# Altium schematic sheet Power Input.SchDoc
size A4
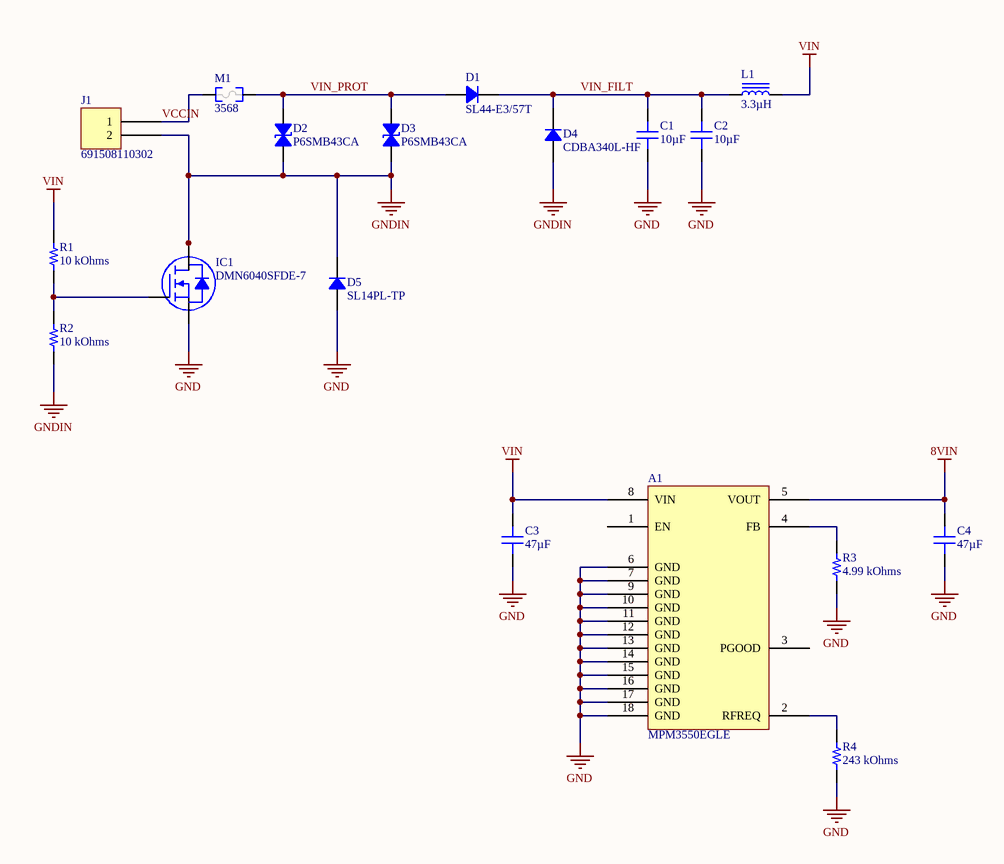
[diagram p0: Power Input.SchDoc]

## Parts
A1  MPM3550EGLE  [MPS LGA-18 12x12x4.2mm]
C1  10µF  [CAP 1210_3225 - 2.8MM]
C2  10µF  [CAP 1210_3225 - 2.8MM]
C3  47µF  [CAP 1210_3225 - 2.8MM]
C4  47µF  [CAP 1210_3225 - 2.8MM]
D1  SL44-E3/57T  [DO214AB SMC]
D2  P6SMB43CA  [DO214AA SMB]
D3  P6SMB43CA  [DO214AA SMB]
D4  CDBA340L-HF  [DO214AC SMA]
D5  SL14PL-TP  [SOD123F]
IC1  DMN6040SFDE-7  [DIODES U-DFN2020-6E]
J1  691508110302  [WURTH 691508110302]
L1  3.3µH  [BOURNS SRP5030T]
M1  3568  [KEYSTONE 3568]
R1  10 kOhms  [RES 0201_0603]
R2  10 kOhms  [RES 0201_0603]
R3  4.99 kOhms  [RES 0201_0603]
R4  243 kOhms  [RES 0201_0603]

## Nets
8VIN: A1.5(VOUT) C4.2
GND: A1.6(GND) A1.7(GND) A1.9(GND) A1.10(GND) A1.11(GND) A1.12(GND) A1.13(GND) A1.14(GND) A1.15(GND) A1.16(GND) A1.17(GND) A1.18(GND) C1.1 C2.1 C3.1 C4.1 D5.1 IC1.S R3.1 R4.1
GNDIN: D2.1 D3.1 D4.1 D5.2 IC1.D(Drain) J1.2 R2.1
VIN: A1.8(VIN) C3.2 L1.2 R1.1
VCCIN: J1.1 M1.1
VIN_FILT: C1.2 C2.2 D1.2 D4.2 L1.1
VIN_PROT: D1.1 D2.2 D3.2 M1.2
NetA1_2: A1.2(RFREQ) R4.2
NetA1_4: A1.4(FB) R3.2
NetIC1_G: IC1.G R1.2 R2.2

Not connected (* = marked no-connect by the designer): A1 1(EN) 3(PGOOD)

## Notes on the sheet
- Title
- Size:
- Date:
- A4
- Number:
- Time:
- Revision:
- Sheet
- of
- File:

## Library data of the parts
A1 = MPM3550EGLE: DC/DC POWER MODULE 5A 1.0 TO 12.; Manufacturer: Monolithic Power Systems Inc.; Efficiency: 94.6%; Number of Outputs: 1; Voltage - Input (Max): 36V; Voltage - Input (Min): 4.5V; Voltage - Output 1: 1 ~ 12V; Part Number: MPM3550EGLE; Applications: ITE (Commercial); ComponentLink1Description: Datasheet; ComponentLink1URL: https://www.monolithicpower.com/en/documentview/productdocument/index/doc_url/L20vcC9tcG0zNTUwZV9yMS4wLnBkZg/prod_id/MzE5Ng/; ComponentLink2Description: DigiKey Link; ComponentLink2URL: http://digikey.com/product-detail/en/monolithic-power-systems-inc/MPM3550EGLE/1589-2043-ND/10223607; Current - Output (Max): 5A; Device Package: 18-BLGA Module; Features: OCP, OTP, SCP, UVLO; LastUpdated: 05/04/2020 00:28:48; Lifecycle Status: Active; Minimum Order: 1; Mounting Type: Surface Mount; Operating Temperature: -40°C ~ 125°C; Package / Case: 18-BLGA Module; Packaging: Unknown; PartId: 26; Part Status: Active; Price: 9.16; Series: -; Size / Dimension: 0.47" L x 0.47" W x 0.17" H (12.0mm x 12.0mm x 4.2mm); Supplier 1: DigiKey; Supplier Part Number 1: 1589-2043-ND; Supplier Device Package: 18-LGA (12x12); Type: Non-Isolated PoL Module
C1 C2 = CL32B106KBJNNNE: CAP CER 10UF 50V X7R 1210; Manufacturer: Samsung Electro-Mechanics; Tolerance: ±10%; Part Number: CL32B106KBJNNNE; Value: 10µF; Applications: General Purpose; Capacitance: 10µF; ComponentLink1Description: Datasheet; ComponentLink1URL: http://www.samsungsem.com/kr/support/product-search/mlcc/CL32B106KBJNNNE .jsp; ComponentLink2Description: DigiKey Link; ComponentLink2URL: http://digikey.com/product-detail/en/samsung-electro-mechanics/CL32B106KBJNNNE/1276-3387-1-ND/3891473; Device Package: 1210 (3225 Metric); LastUpdated: 21/01/2020 00:30:21; Lifecycle Status: Active; Minimum Order: 1; Mounting Type: Surface Mount, MLCC; Operating Temperature: -55°C ~ 125°C; Package / Case: 1210 (3225 Metric); Packaging: TapeAndReel; PartId: 24115; Part Status: Active; Price: 0.17; Series: CL; Size / Dimension: 0.126" L x 0.098" W (3.20mm x 2.50mm); Supplier 1: DigiKey; Supplier Part Number 1: 1276-3387-1-ND; Temperature Coefficient: X7R; Thickness (Max): 0.106" (2.70mm); Voltage - Rated: 50V
C3 C4 = LMK325B7476MM-PR: CAP CER 47UF 10V X7R 1210; Manufacturer: Taiyo Yuden; Tolerance: ±20%; Part Number: LMK325B7476MM-PR; Value: 47µF; Applications: General Purpose; Capacitance: 47µF; ComponentLink1Description: Datasheet; ComponentLink1URL: https://www.yuden.co.jp/productdata/catalog/mlcc01_e.pdf; ComponentLink2Description: DigiKey Link; ComponentLink2URL: http://digikey.com/product-detail/en/taiyo-yuden/LMK325B7476MM-PR/587-5922-1-ND/7675042; Device Package: 1210 (3225 Metric); LastUpdated: 21/01/2020 00:30:21; Lifecycle Status: Active; Minimum Order: 1; Mounting Type: Surface Mount, MLCC; Operating Temperature: -55°C ~ 125°C; Package / Case: 1210 (3225 Metric); Packaging: TapeAndReel; PartId: 24091; Part Status: Active; Price: 0.28; Series: M; Size / Dimension: 0.126" L x 0.098" W (3.20mm x 2.50mm); Supplier 1: DigiKey; Supplier Part Number 1: 587-5922-1-ND; Temperature Coefficient: X7R; Thickness (Max): 0.106" (2.70mm); Voltage - Rated: 10V
D1 = SL44-E3/57T: DIODE SCHOTTKY 40V 4A DO214AB; Manufacturer: Vishay Semiconductor Diodes Division; Current - Reverse Leakage @ Vr: 500µA @ 40V; Speed: Fast Recovery =< 500ns, > 200mA (Io); Voltage - Forward (Vf) (Max) @ If: 440mV @ 4A; Part Number: SL44-E3/57T; ComponentLink1Description: Datasheet; ComponentLink1URL: http://www.vishay.com/docs/88742/sl42.pdf; ComponentLink2Description: DigiKey Link; ComponentLink2URL: http://digikey.com/product-detail/en/vishay-semiconductor-diodes-division/SL44-E3-57T/SL44-E3-57TGICT-ND/1091623; Current - Average Rectified (Io): 4A; Device Package: DO-214AB, SMC; Diode Type: Schottky; LastUpdated: 21/01/2020 02:38:50; Lifecycle Status: Active; Minimum Order: 1; Mounting Type: Surface Mount; Operating Temperature - Junction: -55°C ~ 125°C; Package / Case: DO-214AB, SMC; Packaging: TapeAndReel; PartId: 1768; Part Status: Active; Price: 0.42; Series: -; Supplier 1: DigiKey; Supplier Part Number 1: SL44-E3/57TGICT-ND; Supplier Device Package: DO-214AB (SMC); Voltage - DC Reverse (Vr) (Max): 40V
D2 D3 = P6SMB43CA: TVS DIODE 36.8V 59.3V DO214AA; Manufacturer: Bourns Inc.; Bidirectional Channels: 1; Current - Peak Pulse (10/1000µs): 10.3A; Power Line Protection: No; Power - Peak Pulse: 600W; Type: Zener; Voltage - Breakdown (Min): 40.9V; Part Number: P6SMB43CA; Applications: General Purpose; ComponentLink1Description: Datasheet; ComponentLink1URL: https://www.bourns.com/docs/Product-Datasheets/P6SMB.pdf; ComponentLink2Description: DigiKey Link; ComponentLink2URL: http://digikey.com/product-detail/en/bourns-inc/P6SMB43CA/P6SMB43CABBCT-ND/6708253; Device Package: DO-214AA, SMB; LastUpdated: 21/03/2020 01:01:48; Lifecycle Status: Active; Minimum Order: 1; Mounting Type: Surface Mount; Operating Temperature: -55°C ~ 150°C (TJ); Package / Case: DO-214AA, SMB; Packaging: TapeAndReel; PartId: 8863; Part Status: Active; Price: 0.11; Series: -; Supplier 1: DigiKey; Supplier Part Number 1: P6SMB43CABBCT-ND; Supplier Device Package: DO-214AA (SMB); Voltage - Clamping (Max) @ Ipp: 59.3V; Voltage - Reverse Standoff (Typ): 36.8V
D4 = CDBA340L-HF: DIODE SCHOTTKY 40V 3A DO214AC; Manufacturer: Comchip Technology; Capacitance @ Vr, F: 300pF @ 4V, 1MHz; Current - Average Rectified (Io): 3A (DC); Current - Reverse Leakage @ Vr: 1mA @ 40V; Speed: Fast Recovery =< 500ns, > 200mA (Io); Voltage - Forward (Vf) (Max) @ If: 400mV @ 3A; Part Number: CDBA340L-HF; ComponentLink1Description: Datasheet; ComponentLink1URL: http://www.comchiptech.com/admin/files/product/CDBA340L-HF%20RevC514368.pdf; ComponentLink2Description: DigiKey Link; ComponentLink2URL: http://digikey.com/product-detail/en/comchip-technology/CDBA340L-HF/641-1702-1-ND/5226085; Device Package: DO-214AC, SMA; Diode Type: Schottky; LastUpdated: 02/02/2020 10:17:41; Lifecycle Status: Active; Minimum Order: 1; Mounting Type: Surface Mount; Operating Temperature - Junction: -50°C ~ 100°C; Package / Case: DO-214AC, SMA; Packaging: TapeAndReel; PartId: 1972; Part Status: Active; Price: 0.20; Series: -; Supplier 1: DigiKey; Supplier Part Number 1: 641-1702-1-ND; Supplier Device Package: DO-214AC (SMA); Voltage - DC Reverse (Vr) (Max): 40V
D5 = SL14PL-TP: DIODE SCHOTTKY 1A 40V SOD-123FL; Manufacturer: Micro Commercial Co; Current - Reverse Leakage @ Vr: 500µA @ 40V; Speed: Fast Recovery =< 500ns, > 200mA (Io); Voltage - Forward (Vf) (Max) @ If: 400mV @ 1A; Part Number: SL14PL-TP; ComponentLink1Description: Datasheet; ComponentLink1URL: https://www.mccsemi.com/pdf/Products/SL14PL-SL110PL(SOD-123FL)-B.pdf; ComponentLink2Description: DigiKey Link; ComponentLink2URL: http://digikey.com/product-detail/en/micro-commercial-co/SL14PL-TP/SL14PL-TPMSCT-ND/7681629; Current - Average Rectified (Io): 1A; Device Package: SOD-123F; Diode Type: Schottky; LastUpdated: 21/01/2020 02:43:49; Lifecycle Status: Active; Minimum Order: 1; Mounting Type: Surface Mount; Operating Temperature - Junction: -55°C ~ 150°C; Package / Case: SOD-123F; Packaging: TapeAndReel; PartId: 2344; Part Status: Active; Price: 0.06; Series: -; Supplier 1: DigiKey; Supplier Part Number 1: SL14PL-TPMSCT-ND; Supplier Device Package: SOD-123FL; Voltage - DC Reverse (Vr) (Max): 40V
IC1 = DMN6040SFDE-7: MOSFET N-CH 60V 5.3A U-DFN; Manufacturer: Diodes Incorporated; Current - Continuous Drain (Id) @ 25°C: 5.3A (Ta); Drive Voltage (Max Rds On,  Min Rds On): 4.5V, 10V; FET Type: N-Channel; Gate Charge (Qg) (Max) @ Vgs: 22.4nC @ 10V; Input Capacitance (Ciss) (Max) @ Vds: 1287pF @ 25V; Power Dissipation (Max): 660mW (Ta); Rds On (Max) @ Id, Vgs: 38mOhm @ 4.3A, 10V; Vgs (Max): ±20V; Vgs(th) (Max) @ Id: 3V @ 250µA; Part Number: DMN6040SFDE-7; ComponentLink1Description: Datasheet; ComponentLink1URL: https://www.diodes.com/assets/Datasheets/DMN6040SFDE.pdf; ComponentLink2Description: DigiKey Link; ComponentLink2URL: http://digikey.com/product-detail/en/diodes-incorporated/DMN6040SFDE-7/DMN6040SFDE-7DICT-ND/3451573; Device Package: 6-UDFN Exposed Pad; Drain to Source Voltage (Vdss): 60V; LastUpdated: 30/03/2020 13:01:59; Lifecycle Status: Active; Minimum Order: 1; Mounting Type: Surface Mount; Operating Temperature: -55°C ~ 150°C (TJ); Package / Case: 6-UDFN Exposed Pad; Packaging: TapeAndReel; Part Status: Active; Price: 0.20; Series: -; Supplier 1: DigiKey; Supplier Part Number 1: DMN6040SFDE-7DICT-ND; Supplier Device Package: U-DFN2020-6 (Type E); Technology: MOSFET (Metal Oxide)
J1 = 691508110302: TERM BLOCK 2POS 3.5MM SMD; Manufacturer: Würth Elektronik; Current: 10A; Mating Orientation: Horizontal and Vertical with Board; Number of Levels: 1; Pitch: 0.138" (3.50mm); Positions Per Level: 2; Voltage: 300V; Wire Gauge: 16-30 AWG; Wire Termination: Screw - Rising Cage Clamp; Part Number: 691508110302; Color: Black; ComponentLink1Description: Datasheet; ComponentLink1URL: https://katalog.we-online.de/em/datasheet/6915081103xx.pdf; ComponentLink2Description: DigiKey Link; ComponentLink2URL: http://digikey.com/product-detail/en/w-rth-elektronik/691508110302/732-5963-1-ND/5047612; Features: Board Guide, Mounting Flange; LastUpdated: 15/01/2020 04:18:55; Lifecycle Status: Active; Minimum Order: 1; Mounting Type: Surface Mount; Packaging: TapeAndReel; Part Status: Active; Price: 1.57; Series: WR-TBL Series 5081; Supplier 1: DigiKey; Supplier Part Number 1: 732-5963-1-ND
L1 = SRP5030T-3R3M: FIXED IND 3.3UH 5A 38 MOHM SMD; Manufacturer: Bourns Inc.; Current - Saturation: 8A; DC Resistance (DCR): 38mOhm Max; Inductance Frequency - Test: 100kHz; Material - Core: Iron Powder; Shielding: Shielded; Tolerance: ±20%; Type: Wirewound; Part Number: SRP5030T-3R3M; ComponentLink1Description: Datasheet; ComponentLink1URL: https://www.bourns.com/docs/Product-Datasheets/SRP5030T.pdf; ComponentLink2Description: DigiKey Link; ComponentLink2URL: http://digikey.com/product-detail/en/bourns-inc/SRP5030T-3R3M/SRP5030T-3R3MCT-ND/3986025; Current Rating (Amps): 5A; Device Package: Nonstandard; Height - Seated (Max): 0.118" (3.00mm); Inductance: 3.3µH; LastUpdated: 21/01/2020 03:25:23; Lifecycle Status: Active; Minimum Order: 1; Mounting Type: Surface Mount; Operating Temperature: -40°C ~ 125°C; Package / Case: Nonstandard; Packaging: TapeAndReel; PartId: 6; Part Status: Active; Price: 0.66; Series: SRP5030T; Size / Dimension: 0.224" L x 0.205" W (5.70mm x 5.20mm); Supplier 1: DigiKey; Supplier Part Number 1: SRP5030T-3R3MCT-ND; Value: 3.3µH
M1 = 3568: FUSE HOLDER BLADE 500V 30A PCB; Manufacturer: Keystone Electronics; For Use With/Related Products: MINI ATC, MINI ATO; Fuse Size: 0.43" L x 0.15" W x 0.347" H (10.92mm x 3.81mm x 8.81mm); Number of Circuits: 1; Part Number: 3568; ComponentLink1Description: Datasheet; ComponentLink1URL: http://keyelco.com/userAssets/file/M65p42.pdf; ComponentLink2Description: DigiKey Link; ComponentLink2URL: http://digikey.com/product-detail/en/keystone-electronics/3568/36-3568-ND/2137306; Contact Finish: Tin; Contact Material: Brass; Current Rating (Amps): 30A; Fuseholder Type: Holder; Fuse Type: Blade; LastUpdated: 05/04/2020 19:02:49; Lifecycle Status: Active; Minimum Order: 1; Mounting Type: Through Hole; Orientation: Vertical; Packaging: Unknown; Part Status: Active; Price: 1.03; Series: MINI® 297; Supplier 1: DigiKey; Supplier Part Number 1: 36-3568-ND; Termination Style: PC Pin; Voltage: 500V
R1 R2 = ERJ-1GNF1002C: RES SMD 10K OHM 1% 1/20W 0201; Manufacturer: Panasonic Electronic Components; Power (Watts): 0.05W, 1/20W; Temperature Coefficient: ±200ppm/°C; Part Number: ERJ-1GNF1002C; Value: 10 kOhms; ComponentLink1Description: Datasheet; ComponentLink1URL: https://industrial.panasonic.com/cdbs/www-data/pdf/RDA0000/AOA0000C304.pdf; ComponentLink2Description: DigiKey Link; ComponentLink2URL: http://digikey.com/product-detail/en/panasonic-electronic-components/ERJ-1GNF1002C/P122414CT-ND/7389440; Composition: Thick Film; Device Package: 0201 (0603 Metric); Features: Automotive AEC-Q200; Height - Seated (Max): 0.010" (0.26mm); LastUpdated: 21/01/2020 00:04:13; Lifecycle Status: Active; Minimum Order: 1; Number of Terminations: 2; Operating Temperature: -55°C ~ 125°C; Package / Case: 0201 (0603 Metric); Packaging: TapeAndReel; PartId: 2296; Part Status: Active; Price: 0.01; Ratings: AEC-Q200; Resistance: 10 kOhms; Series: ERJ; Size / Dimension: 0.024" L x 0.012" W (0.60mm x 0.30mm); Supplier 1: DigiKey; Supplier Part Number 1: P122414CT-ND; Supplier Device Package: 0201; Tolerance: ±1%
R3 = ERJ-1GNF4991C: RES SMD 4.99K OHM 1% 1/20W 0201; Manufacturer: Panasonic Electronic Components; Power (Watts): 0.05W, 1/20W; Temperature Coefficient: ±200ppm/°C; Part Number: ERJ-1GNF4991C; Value: 4.99 kOhms; ComponentLink1Description: Datasheet; ComponentLink1URL: https://industrial.panasonic.com/cdbs/www-data/pdf/RDA0000/AOA0000C304.pdf; ComponentLink2Description: DigiKey Link; ComponentLink2URL: http://digikey.com/product-detail/en/panasonic-electronic-components/ERJ-1GNF4991C/P123046CT-ND/8343031; Composition: Thick Film; Device Package: 0201 (0603 Metric); Features: Automotive AEC-Q200; Height - Seated (Max): 0.010" (0.26mm); LastUpdated: 21/01/2020 00:04:10; Lifecycle Status: Active; Minimum Order: 1; Number of Terminations: 2; Operating Temperature: -55°C ~ 125°C; Package / Case: 0201 (0603 Metric); Packaging: TapeAndReel; PartId: 4175; Part Status: Active; Price: 0.01; Ratings: AEC-Q200; Resistance: 4.99 kOhms; Series: ERJ; Size / Dimension: 0.024" L x 0.012" W (0.60mm x 0.30mm); Supplier 1: DigiKey; Supplier Part Number 1: P123046CT-ND; Supplier Device Package: 0201; Tolerance: ±1%
R4 = ERJ-1GNF2433C: RES SMD 243K OHM 1% 1/20W 0201; Manufacturer: Panasonic Electronic Components; Power (Watts): 0.05W, 1/20W; Temperature Coefficient: ±200ppm/°C; Part Number: ERJ-1GNF2433C; Value: 243 kOhms; ComponentLink1Description: Datasheet; ComponentLink1URL: https://industrial.panasonic.com/cdbs/www-data/pdf/RDA0000/AOA0000C304.pdf; ComponentLink2Description: DigiKey Link; ComponentLink2URL: http://digikey.com/product-detail/en/panasonic-electronic-components/ERJ-1GNF2433C/P122863CT-ND/8342665; Composition: Thick Film; Device Package: 0201 (0603 Metric); Features: Automotive AEC-Q200; Height - Seated (Max): 0.010" (0.26mm); LastUpdated: 21/01/2020 00:04:11; Lifecycle Status: Active; Minimum Order: 1; Number of Terminations: 2; Operating Temperature: -55°C ~ 125°C; Package / Case: 0201 (0603 Metric); Packaging: TapeAndReel; PartId: 3464; Part Status: Active; Price: 0.01; Ratings: AEC-Q200; Resistance: 243 kOhms; Series: ERJ; Size / Dimension: 0.024" L x 0.012" W (0.60mm x 0.30mm); Supplier 1: DigiKey; Supplier Part Number 1: P122863CT-ND; Supplier Device Package: 0201; Tolerance: ±1%